# Altium schematic sheet Sheet1.SchDoc: Наименование
size 420 x 297 mm; ApprovedBy: Утвердил; CheckedBy: Проверил; Author: Разработал; CompanyName: Организация; DrawnBy: Н.Контр; Engineer: Т.Контр; SheetNumber: 1; SheetTotal: 1; PageSetup: Record=PageOptions|CenterHorizontal=True|CenterVertical=True|PrintScale=0.94|XCorrection=1.00|YCorrection=1.00|PrintKind=1|BorderSize=5000000|LeftOffset=0|BottomOffset=0|Orientation=1|PaperLength=1000|PaperWidth=1000|Scale=100|PaperSource=7|PrintQuality=-4|MediaType=1|DitherType=10|PaperKind=A4|PrintScaleMode=1; DecimalNumber: Децимальный номер; HeadOfSector: Нач. сектора; MainDevice: Перв.примен.; Name: Наименование; DocumentName: Sheet1.SCHDOC
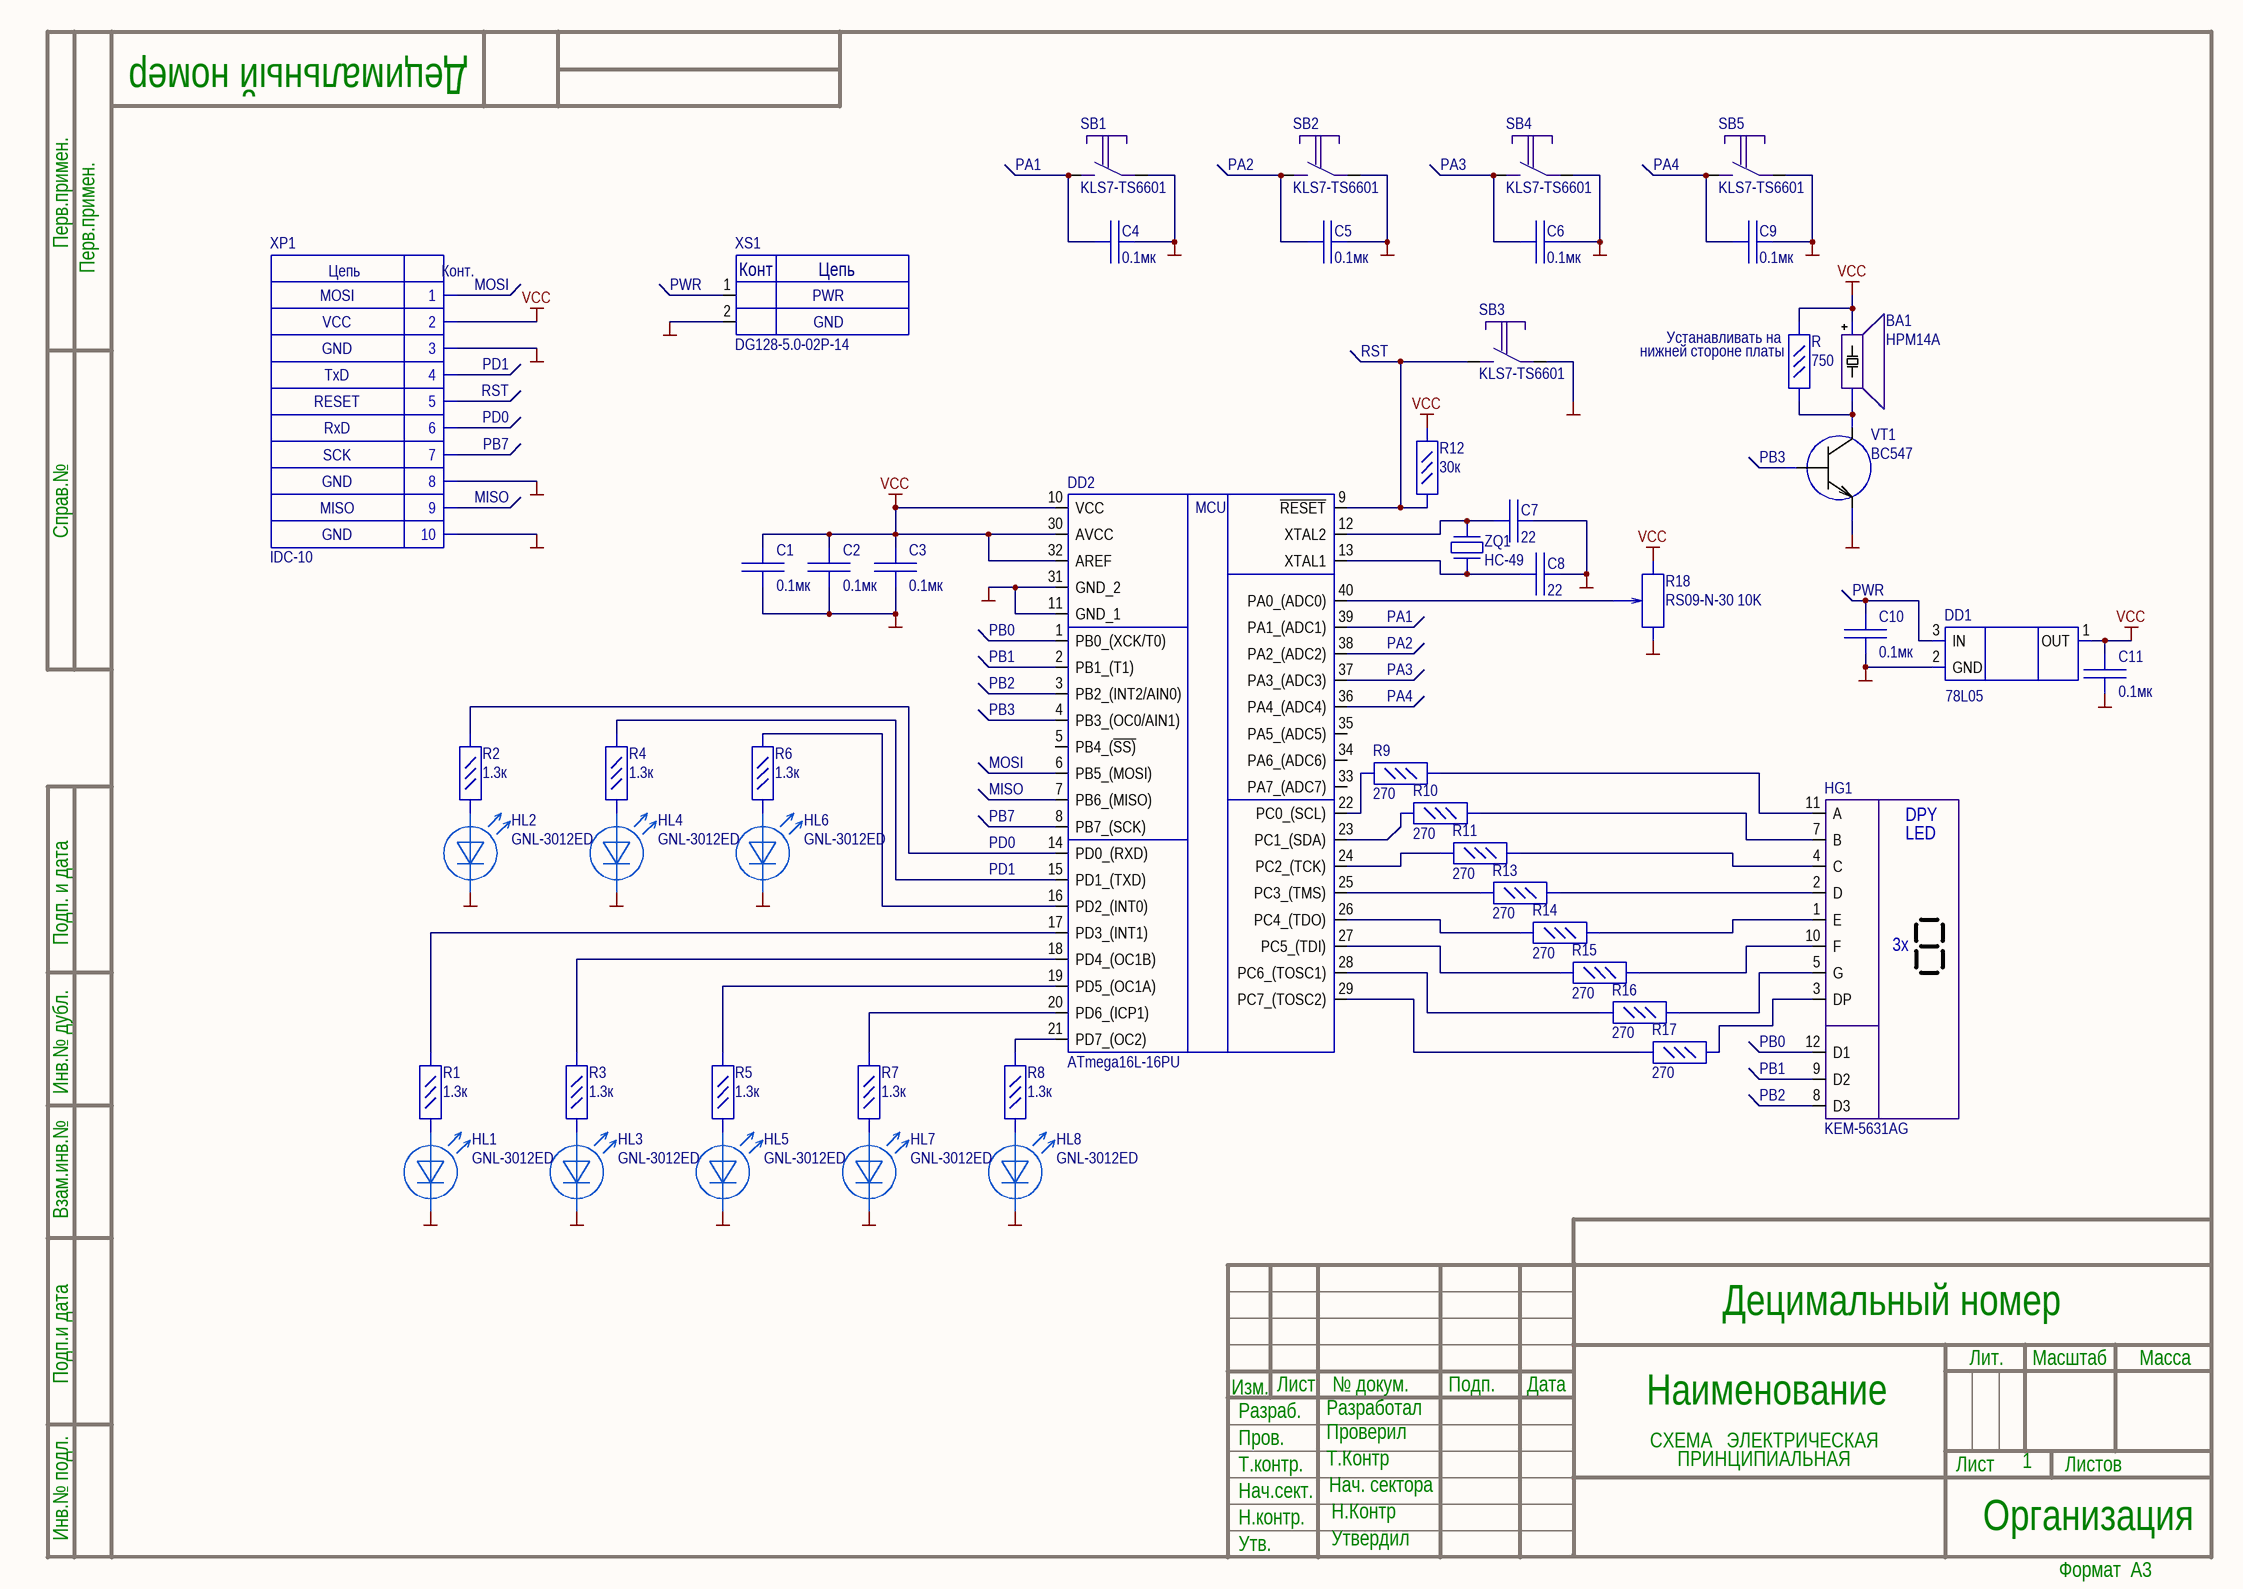
[diagram p0: Sheet1.SchDoc]

## Parts
BA1  HPM14A  [HPM14A]
C1  0.1мк  [К10-17Б]
C2  0.1мк  [К10-17Б]
C3  0.1мк  [К10-17Б]
C4  0.1мк  [К10-17Б]
C5  0.1мк  [К10-17Б]
C6  0.1мк  [К10-17Б]
C7  22  [К10-17Б]
C8  22  [К10-17Б]
C9  0.1мк  [К10-17Б]
C10  0.1мк  [К10-17Б]
C11  0.1мк  [К10-17Б]
DD1  78L05  [КТ-26]
DD2  ATmega16L-16PU  [DIP-40]
HG1  KEM-5631AG  [BC56]
HL1  GNL-3012ED  [GNL-3012ED]
HL2  GNL-3012ED  [GNL-3012ED]
HL3  GNL-3012ED  [GNL-3012ED]
HL4  GNL-3012ED  [GNL-3012ED]
HL5  GNL-3012ED  [GNL-3012ED]
HL6  GNL-3012ED  [GNL-3012ED]
HL7  GNL-3012ED  [GNL-3012ED]
HL8  GNL-3012ED  [GNL-3012ED]
R  750  [С2-23_2W_R]
R1  1.3к  [С2-23_2W_R]
R2  1.3к  [С2-23_2W_R]
R3  1.3к  [С2-23_2W_R]
R4  1.3к  [С2-23_2W_R]
R5  1.3к  [С2-23_2W_R]
R6  1.3к  [С2-23_2W_R]
R7  1.3к  [С2-23_2W_R]
R8  1.3к  [С2-23_2W_R]
R9  270  [С2-23_2W_R]
R10  270  [С2-23_2W_R]
R11  270  [С2-23_2W_R]
R12  30к  [С2-23_2W_R]
R13  270  [С2-23_2W_R]
R14  270  [С2-23_2W_R]
R15  270  [С2-23_2W_R]
R16  270  [С2-23_2W_R]
R17  270  [С2-23_2W_R]
R18  RS09-N-30 10K  [PTV09A-1]
SB1  KLS7-TS6601  [KLS7-TS6601]
SB2  KLS7-TS6601  [KLS7-TS6601]
SB3  KLS7-TS6601  [KLS7-TS6601]
SB4  KLS7-TS6601  [KLS7-TS6601]
SB5  KLS7-TS6601  [KLS7-TS6601]
VT1  BC547  [КТ-26]
XP1  IDC-10  [IDC-10]
XS1  DG128-5.0-02P-14  [DG128-5.0-02P-14]
ZQ1  HC-49  [HC-49]

## Nets
GND: C1.1 C2.1 C3.1 C4.1 C5.1 C6.1 C7.2 C8.2 C9.1 C10.1 C11.1 DD1.2(GND) DD2.11(GND_1) DD2.31(GND_2) HL1.2 HL2.2 HL3.2 HL4.2 HL5.2 HL6.2 HL7.2 HL8.2 R18.1 SB1.2 SB2.2 SB3.2 SB4.2 SB5.2 VT1.3(E) XP1.3 XP1.8 XP1.10 XS1.2
VCC: BA1.1 C1.2 C2.2 C3.2 C11.2 DD1.1(OUT) DD2.10(VCC) DD2.30(AVCC) DD2.32(AREF) R.2 R12.1 R18.3 XP1.2
MISO: DD2.7(PB6_(MISO)) XP1.9
MOSI: DD2.6(PB5_(MOSI)) XP1.1
PA1: C4.2 DD2.39(PA1_(ADC1)) SB1.1
PA2: C5.2 DD2.38(PA2_(ADC2)) SB2.1
PA3: C6.2 DD2.37(PA3_(ADC3)) SB4.1
PA4: C9.2 DD2.36(PA4_(ADC4)) SB5.1
PB0: DD2.1(PB0_(XCK/T0)) HG1.12(D1)
PB1: DD2.2(PB1_(T1)) HG1.9(D2)
PB2: DD2.3(PB2_(INT2/AIN0)) HG1.8(D3)
PB3: DD2.4(PB3_(OC0/AIN1)) VT1.2(B)
PB7: DD2.8(PB7_(SCK)) XP1.7
PD0: DD2.14(PD0_(RXD)) R2.2 XP1.6
PD1: DD2.15(PD1_(TXD)) R4.2 XP1.4
PWR: C10.2 DD1.3(IN) XS1.1
RST: DD2.9(~{RESET}) R12.2 SB3.1 XP1.5
NetBA1_2: BA1.2 R.1 VT1.1(C)
NetC7_1: C7.1 DD2.12(XTAL2) ZQ1.1
NetC8_1: C8.1 DD2.13(XTAL1) ZQ1.2
NetDD2_16: DD2.16(PD2_(INT0)) R6.2
NetDD2_17: DD2.17(PD3_(INT1)) R1.2
NetDD2_18: DD2.18(PD4_(OC1B)) R3.2
NetDD2_19: DD2.19(PD5_(OC1A)) R5.2
NetDD2_20: DD2.20(PD6_(ICP1)) R7.2
NetDD2_21: DD2.21(PD7_(OC2)) R8.2
NetDD2_22: DD2.22(PC0_(SCL)) R9.1
NetDD2_23: DD2.23(PC1_(SDA)) R10.1
NetDD2_24: DD2.24(PC2_(TCK)) R11.1
NetDD2_25: DD2.25(PC3_(TMS)) R13.1
NetDD2_26: DD2.26(PC4_(TDO)) R14.1
NetDD2_27: DD2.27(PC5_(TDI)) R15.1
NetDD2_28: DD2.28(PC6_(TOSC1)) R16.1
NetDD2_29: DD2.29(PC7_(TOSC2)) R17.1
NetDD2_40: DD2.40(PA0_(ADC0)) R18.2
NetHG1_1: HG1.1(E) R14.2
NetHG1_2: HG1.2(D) R13.2
NetHG1_3: HG1.3(DP) R17.2
NetHG1_4: HG1.4(C) R11.2
NetHG1_5: HG1.5(G) R16.2
NetHG1_7: HG1.7(B) R10.2
NetHG1_10: HG1.10(F) R15.2
NetHG1_11: HG1.11(A) R9.2
NetHL1_1: HL1.1 R1.1
NetHL2_1: HL2.1 R2.1
NetHL3_1: HL3.1 R3.1
NetHL4_1: HL4.1 R4.1
NetHL5_1: HL5.1 R5.1
NetHL6_1: HL6.1 R6.1
NetHL7_1: HL7.1 R7.1
NetHL8_1: HL8.1 R8.1

Not connected (* = marked no-connect by the designer): DD2 5(PB4_(~{SS)}) 33(PA7_(ADC7)) 34(PA6_(ADC6)) 35(PA5_(ADC5))

## Notes on the sheet
- MOSI
- VCC
- PWR
- GND
- TxD
- RESET
- (near R) нижней стороне платы
- (near R) Устанавливать на
- RxD
- SCK
- MISO
- Перв.примен.
- Справ.№
- Подп. и дата
- Инв.№ дубл.
- Взам.инв.№
- Подп.и дата
- Разраб.
- Изм.
- Лист
- № докум.
- Подп.
- Дата
- Лит.
- Масштаб
- Масса
- Т.контр.
- Пров.
- СХЕМА   ЭЛЕКТРИЧЕСКАЯ
- ПРИНЦИПИАЛЬНАЯ
- Листов
- Инв.№ подл.
- Утв.
- Н.контр.
- Нач.сект.
- Формат  A3
- (in symbol ATmega16L-8PU) MCU
- (in symbol BC56-12SRWA) DPY; LED; 3x
- (in symbol DG128-5.0-02P-14) Конт; Цепь
- (in symbol IDC-10) Цепь; Конт.

## Library data of the parts
C1-C11 = C_К10-17Б
  C1-C6 C9-C11: Value: 0.1мк
  C7 C8: Value: 22
DD1 = 78L05: LDO преобразователь; Name: 78L05
DD2 = ATmega16L-8PU: ATmega16-16PU, Микроконтроллер 8-Бит, AVR, 16МГц, 16КБ Flash [DIP-40]; Manufacturer_Name: Microchip; Datasheet Link: http://ww1.microchip.com/downloads/en/DeviceDoc/doc2466.pdf; Height: 4.826mm; Manufacturer_Part_Number: ATmega16L-8PU; Mouser Part Number: 556-ATMEGA16L-8PU; Mouser Price/Stock: https://www.mouser.co.uk/ProductDetail/Microchip-Technology-Atmel/ATMEGA16L-8PU?qs=aqrrBurbvGfzSW2h8UXBhA%3D%3D; Arrow Part Number: ATMEGA16L-8PU; Arrow Price/Stock: https://www.arrow.com/en/products/atmega16l-8pu/microchip-technology
HG1 = BC56-12SRWA: Индикатор красный ОК, 14.2мм 3х7, 10.5мКд
R R1-R17 = R_DIP
  R1-R8: Value: 1.3к
  R9-R11 R13-R17: Value: 270
  R12: Value: 30к
R18 = PTV09A-4225F-B103: 10 кОм, Резистор переменный
XP1 = IDC-10: System: Connector
BA1 = HPM14A: HelpURL: https://static.chipdip.ru/lib/243/DOC000243438.pdf
VT1 = BC547: Name: BC547